# EasyEDA Pro project ProPrj_2025电赛拓展板7月_2025-07-14.epro

# Schematic Schematic1
Board Name: Board1; Create Date: 2025-07-11; Page Name: P1; Project Name: 2025电赛拓展板7月; Schematic Name: Schematic1; Update Date: 2025-07-13; Company: 嘉立创EDA; Page Size: A4; Version: V1.0
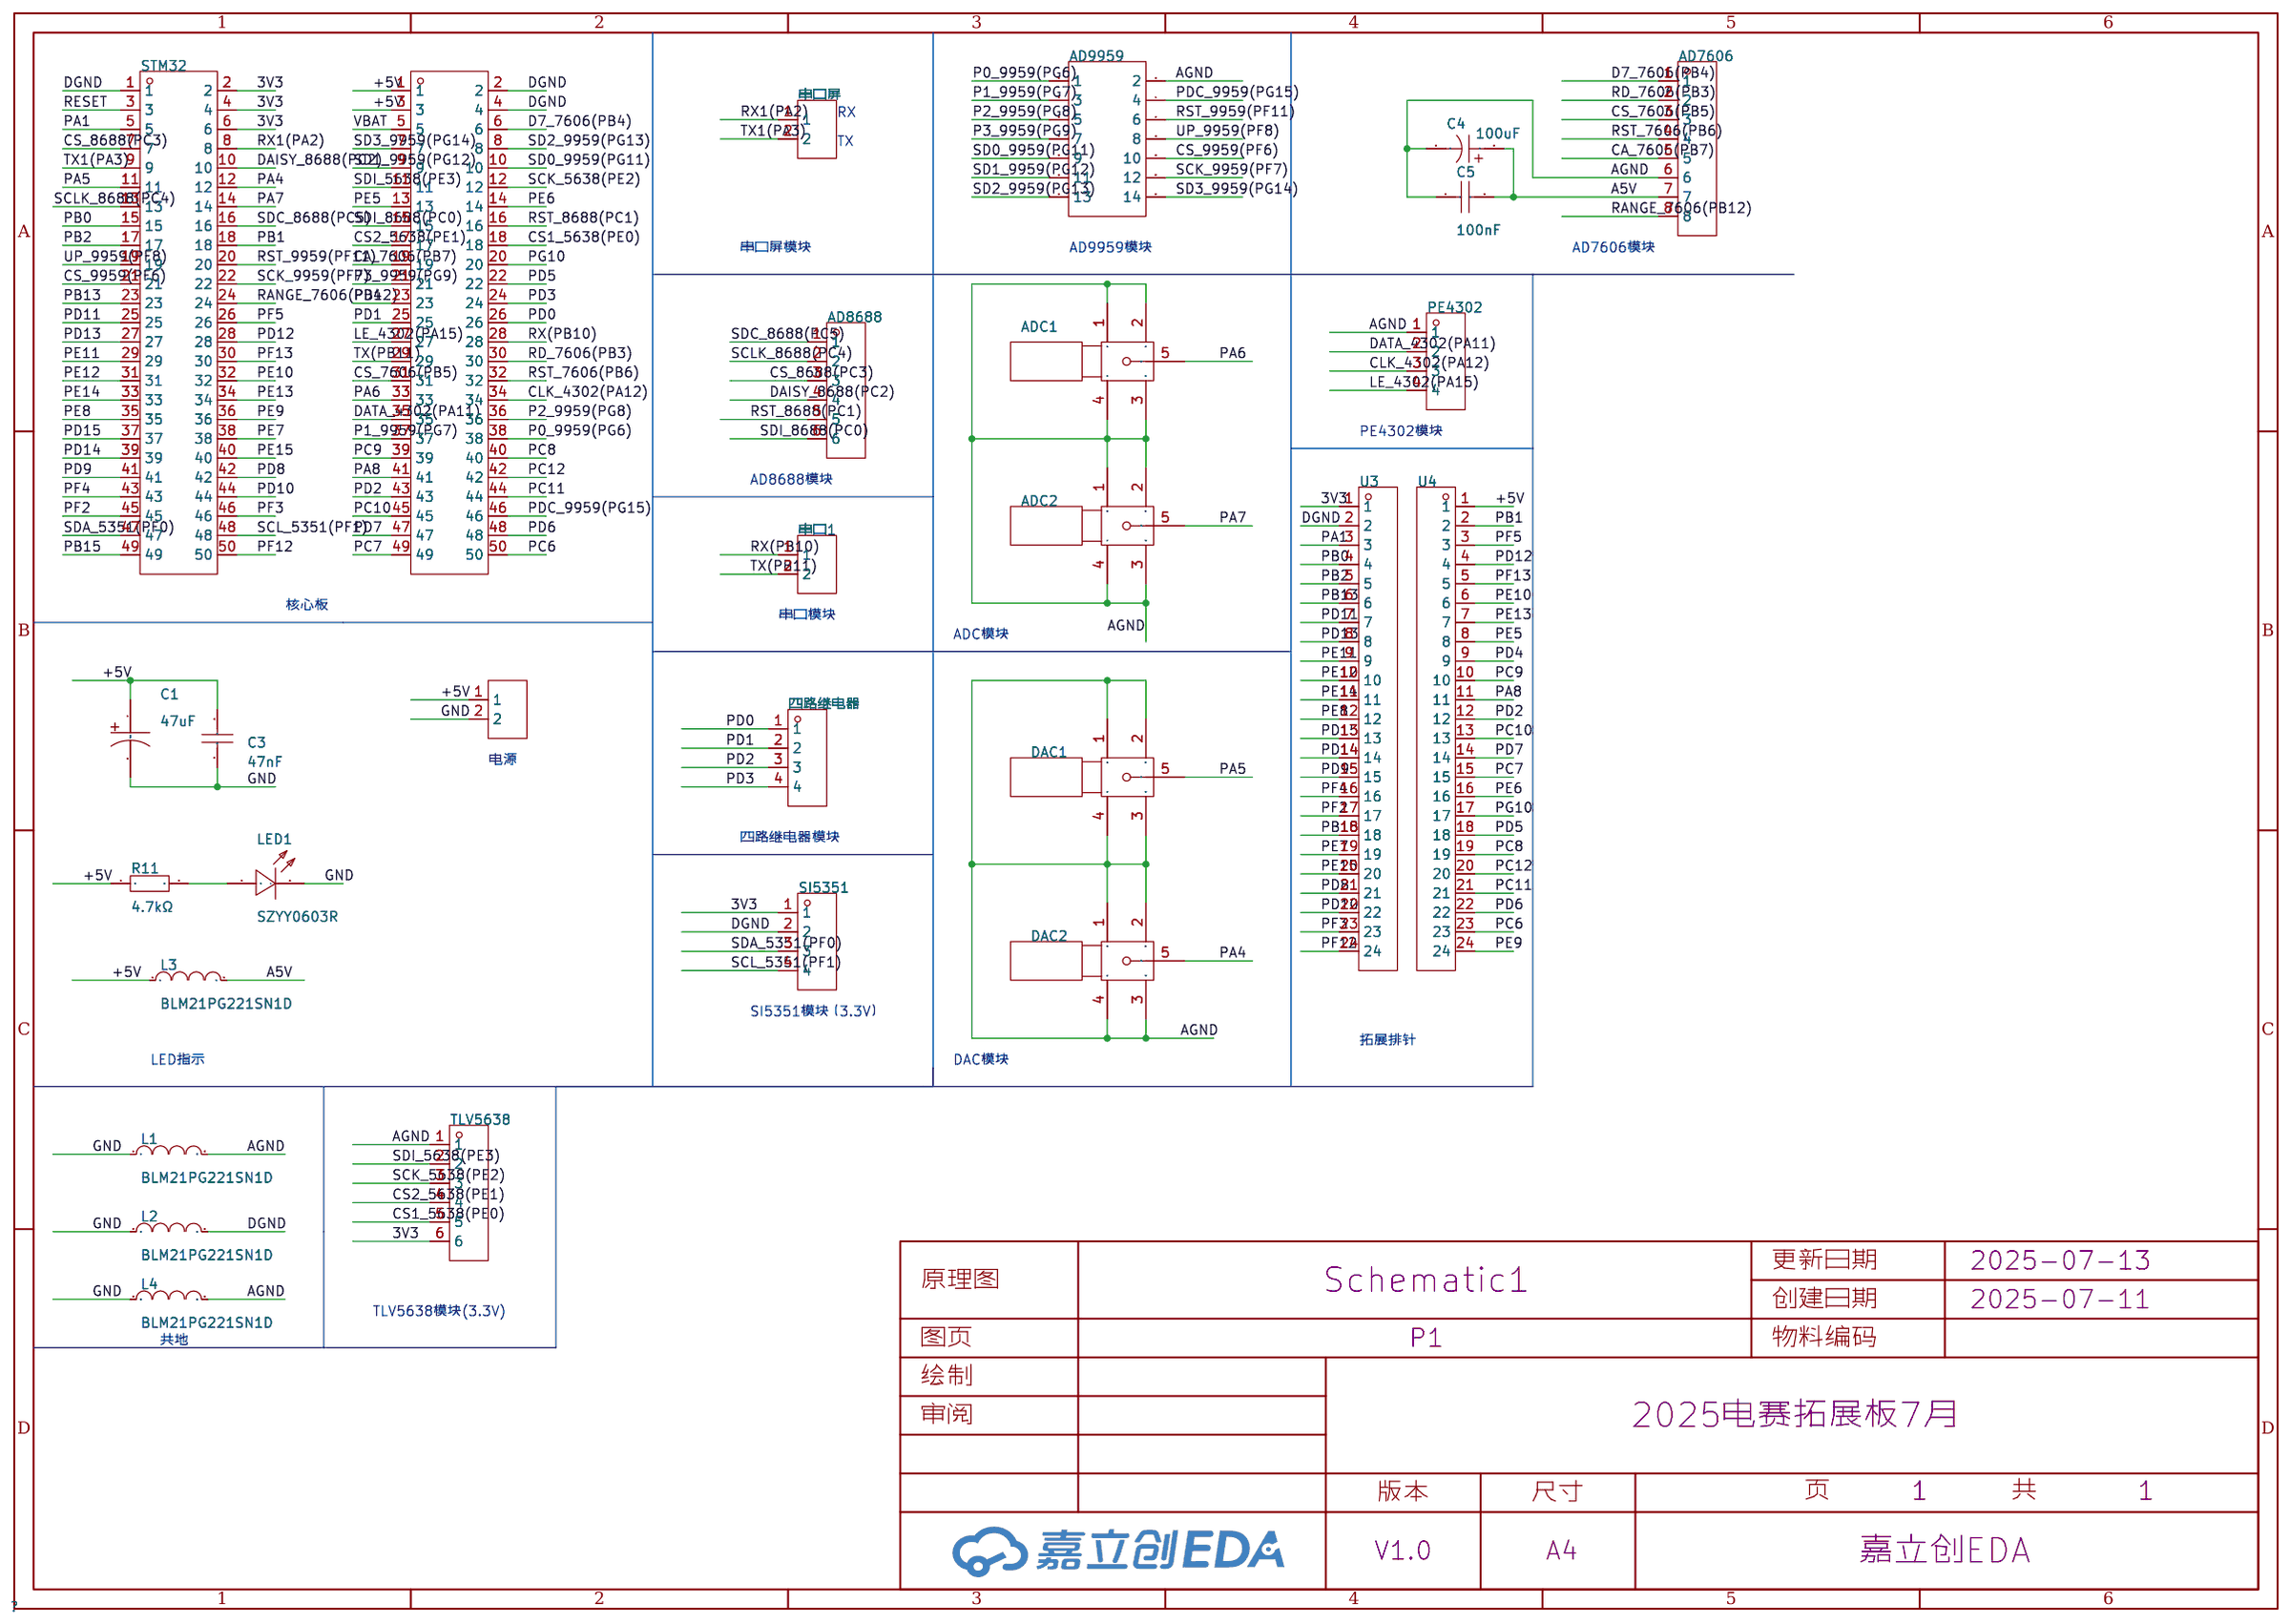
[diagram p0: schematic sheet]

## Parts
AD7606  ZX-XH2.54-8PZZ  [CONN-TH_8P-P2.50-XH2.54-8P]
AD8688  ZX-XH2.54-6PZZ  [CONN-TH_6P-P2.50_ZX-XH2.54-6PZZ]
AD9959  2.54-2*7P简牛  [IDC-TH_14P-P2.54-V-R2-C7-S2.54]
ADC1  BWSMA-KE-P001  [SMA-SMD_BWSMA-KE-P001]
ADC2  BWSMA-KE-P001  [SMA-SMD_BWSMA-KE-P001]
C1  47uF  [CAP-TH_BD5.0-P2.00-D0.8-FD]
C3  47nF  [C0805]
C4  100uF  [CAP-TH_BD8.0-P3.50-D0.5-FD]
C5  100nF  [C0805]
DAC1  BWSMA-KE-P001  [SMA-SMD_BWSMA-KE-P001]
DAC2  BWSMA-KE-P001  [SMA-SMD_BWSMA-KE-P001]
L1  BLM21PG221SN1D  [L0805]
L2  BLM21PG221SN1D  [L0805]
L3  BLM21PG221SN1D  [L0805]
L4  BLM21PG221SN1D  [L0805]
LED1  SZYY0603R  [LED0603-R-RD]
PE4302  ZX-XH2.54-4PZZ  [CONN-TH_4P-P2.50_4PIN]
R11  4.7kΩ  [R0805]
SI5351  ZX-XH2.54-4PZZ  [CONN-TH_4P-P2.50_4PIN]
STM32  ZX-PM2.54-2-25PY  [HDR-TH_50P-P2.54-V-F-R2-C25-S2.54-1]
TLV5638  ZX-XH2.54-6PZZ  [CONN-TH_6P-P2.50_ZX-XH2.54-6PZZ]
U2  ZX-PM2.54-2-25PY  [HDR-TH_50P-P2.54-V-F-R2-C25-S2.54-1]
U3  HC-PM254-8.5H-1x24PZ  [HDR-TH_24P-P2.54-V-F]
U4  HC-PM254-8.5H-1x24PZ  [HDR-TH_24P-P2.54-V-F]
串口  ZX-XH2.54-2PZZ  [CONN-TH_2P-P2.50_HX25003-2A]
串口1  ZX-XH2.54-2PZZ  [CONN-TH_2P-P2.50_HX25003-2A]
串口屏  ZX-XH2.54-2PZZ  [CONN-TH_2P-P2.50_HX25003-2A]
四路继电器  ZX-XH2.54-4PZZ  [CONN-TH_4P-P2.50_4PIN]

## Library data of the parts
AD7606 = ZX-XH2.54-8PZZ: 插针结构:1x8P;间距:2.5mm;安装方式:直插;参考系列:XH;总PIN数:8P;排数:1;每排PIN数:8;行距:-;额定电流:3A;触头材质:黄铜;触头镀层:锡;工作温度:-25℃~+85℃;; LCSC Part Name: 1x8P 间距:2.5mm 直插 系列:XH; Supplier Part: C7429638; Manufacturer: Megastar(兆星); Supplier Footprint: 插件,P=2.5mm; JLCPCB Part Class: 扩展库; Datasheet: https://atta.szlcsc.com/upload/public/pdf/source/20230619/688603DEA58996C00B1F33C46797D2C3.pdf; Supplier: LCSC; Pins Structure: 1x8P; Pitch: 2.5mm; Mounting Type: 直插; Reference Series: XH; Number of Pins: 8P; Number of Rows: 1; Number of PINs Per Row: 8; Current Rating: 3A; Contact Material: 黄铜; Contact Plating: 锡; Operating Temperature: -25℃~+85℃; Voltage Rating: 250V; Plastic Material: PA66; Flame Retardant Rating: UL94V-0; Color: 白色; Z-Height of the Board: 7mm; X-Length of Bottom Edge on Board (Spacing Line): 22.5mm; Y-Width of Bottom Edge on Board: 5.9mm
AD8688 TLV5638 = ZX-XH2.54-6PZZ: 插针结构:1x6P;间距:2.5mm;安装方式:直插;参考系列:XH;总PIN数:6P;排数:1;每排PIN数:6;行距:-;额定电流:3A;触头材质:黄铜;触头镀层:锡;工作温度:-25℃~+85℃;; LCSC Part Name: 1x6P 间距:2.5mm 直插 系列:XH; Supplier Part: C7429636; Manufacturer: Megastar(兆星); Supplier Footprint: 插件,P=2.5mm; JLCPCB Part Class: 扩展库; Datasheet: https://atta.szlcsc.com/upload/public/pdf/source/20230619/1243AD0A516E39CD3D274D8985780568.pdf; Supplier: LCSC; Pins Structure: 1x6P; Pitch: 2.5mm; Mounting Type: 直插; Reference Series: XH; Number of Pins: 6P; Number of Rows: 1; Number of PINs Per Row: 6; Current Rating: 3A; Contact Material: 黄铜; Contact Plating: 锡; Operating Temperature: -25℃~+85℃; Voltage Rating: 250V; Plastic Material: PA66; Flame Retardant Rating: UL94V-0; Color: 白色; Z-Height of the Board: 7mm; X-Length of Bottom Edge on Board (Spacing Line): 17.5mm; Y-Width of Bottom Edge on Board: 5.9mm
AD9959 = 2.54-2*7P简牛: 连接器类型:简牛座;间距:2.54mm;结构:2x7P;封装形式:直插;行距:2.54mm;排数:2;每排PIN数:7;触头材质:黄铜;触头镀层:金;; LCSC Part Name: 2.54mm 2x7P 排数:2 每排P数:7; Supplier Part: C11215; Manufacturer: BOOMELE(博穆精密); Supplier Footprint: 插件,P=2.54mm; Datasheet: https://atta.szlcsc.com/upload/public/pdf/source/20131122/1457706661483.pdf; Supplier: LCSC; Connector Type: 简牛座; Pitch: 2.54mm; Structure: 2x7P; Holder Type: 直插; Row Spacing: 2.54mm; Number of Rows: 2; Pin Number in each Row: 7; Contact Material: 黄铜; Contact Plating: 金
ADC1 ADC2 DAC1 DAC2 = BWSMA-KE-P001: 连接器类型:板端;接口类型:内孔;端口数量:1;接口直径:5.2mm;接口长度/高度:-;频率-最大值:-;射频系列:SMA;阻抗:50Ω;样式:偏脚;工作温度范围:-;; LCSC Part Name: 内孔 SMA 偏脚; Supplier Part: C496550; Manufacturer: BAT WIRELESS(蝙蝠无线); Supplier Footprint: SMD; Datasheet: https://atta.szlcsc.com/upload/public/pdf/source/20240320/28FD502871C976DFF213ABFCF2A0ED51.pdf; Supplier: LCSC; Connector Type: 板端; Interface Type: 内孔; Number of Ports: 1; Interface Diameter: 5.2mm; RF Series: SMA; Impedance: 50Ω; Style: 偏脚
C1 = NXB25V47M5*11 2.5TP: 容值:47uF;精度:±20%;额定电压:25V;纹波电流:250mA@100kHz;等效串联电阻(ESR):300mΩ@100kHz;; LCSC Part Name: 47uF ±20% 25V; Supplier Part: C371230; Manufacturer: SAMYOUNG(韩国三莹); Supplier Footprint: 插件,D5xL11mm; JLCPCB Part Class: 扩展库; Datasheet: https://atta.szlcsc.com/upload/public/pdf/source/20190227/C371244_FA85FFEFC2961227CF12E3CCE8C34A7D.pdf; Supplier: LCSC; Tolerance: ±20%; Voltage Rating: 25V; Ripple Current: 250mA@100kHz; Equivalent Series Resistance(ESR): 300mΩ@100kHz; Pin Spacing: 2mm; Diameter: 5mm; Height - Seated (Max): 11mm; Lifetime: 2000hrs@105℃; Operating Temperature: -40℃~+105℃
C3 = CL21B473KBCNNNC: 容值:47nF;精度:±10%;额定电压:50V;材质(温度系数):X7R;; LCSC Part Name: 47nF ±10% 50V; Supplier Part: C53134; Manufacturer: SAMSUNG(三星); Supplier Footprint: 0805; JLCPCB Part Class: 基础库; Datasheet: https://atta.szlcsc.com/upload/public/pdf/source/20160218/1457707763339.pdf; Supplier: LCSC; Tolerance: ±10%; Voltage Rated: 50V; Temperature Coefficient: X7R
C4 = ERG50V100M8X12: 容值:100uF;精度:±20%;额定电压:50V;纹波电流:680mA@120Hz;等效串联电阻(ESR):120mΩ;; LCSC Part Name: 100uF ±20% 50V; Supplier Part: C47344183; Manufacturer: 捷而瑞; Supplier Footprint: 插件,D8xL12mm; JLCPCB Part Class: 扩展库; Datasheet: https://atta.szlcsc.com/upload/public/pdf/source/20250526/717B4C76834FE5C4A331D19A222D031C.pdf; Supplier: LCSC; Tolerance: ±20%; Voltage Rating: 50V; Ripple Current: 680mA@120Hz; Equivalent Series Resistance(ESR): 120mΩ; Diameter: 8mm; Height - Seated (Max): 12mm; Lifetime: 4000hrs@105℃; Operating Temperature: -40℃~+105℃
C5 = CL21B104KBCNNNC: 容值:100nF;精度:±10%;额定电压:50V;材质(温度系数):X7R;; LCSC Part Name: 100nF ±10% 50V; Supplier Part: C1711; Manufacturer: SAMSUNG(三星); Supplier Footprint: 0805; JLCPCB Part Class: 扩展库; Datasheet: https://atta.szlcsc.com/upload/public/pdf/source/20160218/1457707763339.pdf; Supplier: LCSC; Tolerance: ±10%; Voltage Rated: 50V; Temperature Coefficient: X7R
L1-L4 = BLM21PG221SN1D: 标称阻抗@测试频率:220Ω@100MHz;误差:±25%;直流电阻(RDC):45mΩ;; LCSC Part Name: 单路 0805磁珠 阻抗220Ω@100MHz; Supplier Part: C85840; Manufacturer: muRata(村田); Supplier Footprint: 0805; JLCPCB Part Class: 扩展库; Datasheet: https://atta.szlcsc.com/upload/public/pdf/source/20180326/C118443_3FAC30E9A4F0E6B81275543C61E0685E.pdf; Supplier: LCSC; Impedance @ Frequency: 220Ω@100MHz; Tolerance: ±25%; DC Resistance: 45mΩ; Current Rating: 2A; Circuits: 1
LED1 = SZYY0603R: 发光颜色:红色;功率:40mW;正向电流:20mA;主波长:615nm~630nm;二极管配置:-;透镜颜色:无色透明透镜;色温:-;发光角度:120°;载带方式:-;工作温度:-40℃~+85℃;; LCSC Part Name: 红灯; Supplier Part: C434419; Manufacturer: yongyu(永裕光电); Supplier Footprint: 0603; JLCPCB Part Class: 扩展库; Datasheet: https://atta.szlcsc.com/upload/public/pdf/source/20191204/C434419_0B955C1F73FF88449D9A795B6FF49070.pdf; Supplier: LCSC; Emitted Color: 红色; Power Dissipation: 40mW; Forward Current: 20mA; Dominant Wavelength: 615nm~630nm; Peak Wavelength: 645nm; Lens Color: 无色透明透镜; Viewing Angle: 120°; Operating Temperature: -40℃~+85℃
PE4302 SI5351 四路继电器 = ZX-XH2.54-4PZZ: 插针结构:1x4P;间距:2.5mm;安装方式:直插;参考系列:XH;总PIN数:4P;排数:1;每排PIN数:4;行距:-;额定电流:3A;触头材质:黄铜;触头镀层:锡;工作温度:-25℃~+85℃;; LCSC Part Name: 1x4P 间距:2.5mm 直插 系列:XH; Supplier Part: C7429634; Manufacturer: Megastar(兆星); Supplier Footprint: 插件,P=2.5mm; JLCPCB Part Class: 扩展库; Datasheet: https://atta.szlcsc.com/upload/public/pdf/source/20230619/B529A2163E0159A644AB3383D208FB03.pdf; Supplier: LCSC; Pins Structure: 1x4P; Pitch: 2.5mm; Mounting Type: 直插; Reference Series: XH; Number of Pins: 4P; Number of Rows: 1; Number of PINs Per Row: 4; Current Rating: 3A; Contact Material: 黄铜; Contact Plating: 锡; Operating Temperature: -25℃~+85℃; Voltage Rating: 250V; Plastic Material: PA66; Flame Retardant Rating: UL94V-0; Color: 白色; Z-Height of the Board: 7mm; X-Length of Bottom Edge on Board (Spacing Line): 12.5mm; Y-Width of Bottom Edge on Board: 5.9mm
R11 = 0805W8F4701T5E: 电阻类型:厚膜电阻;阻值:4.7kΩ;精度:±1%;功率:125mW;最大工作电压:150V;温度系数:±100ppm/℃;; LCSC Part Name: 4.7kΩ ±1% 125mW 厚膜电阻; Supplier Part: C17673; Manufacturer: UNI-ROYAL(厚声); Supplier Footprint: 0805; JLCPCB Part Class: 基础库; Datasheet: https://atta.szlcsc.com/upload/public/pdf/source/20200306/C422600_1E6D84923E4A46A82E41ADD87F860B5C.pdf; Supplier: LCSC; Type: 厚膜电阻; Tolerance: ±1%; Power(Watts): 125mW; Overload Voltage (Max): 150V; Temperature Coefficient: ±100ppm/℃; Operating Temperature Range: -55℃~+155℃
STM32 U2 = ZX-PM2.54-2-25PY: 插孔结构:2x25P;间距:2.54mm;行距:2.54mm;圆孔/方孔:方孔;安装类型:直插;排数:双排;总孔位数:50P;额定电流:-;额定电压:1kV;插孔方向:顶部;塑高:8.5mm;触头材质:-;触头镀层:金;工作温度范围:-40℃~+105℃;焊接温度(最大值):260℃@5S;; LCSC Part Name: 2x25P 间距:2.54mm 直插; Supplier Part: C7499355; Manufacturer: Megastar(兆星); Supplier Footprint: 插件,P=2.54mm; JLCPCB Part Class: 扩展库; Datasheet: https://atta.szlcsc.com/upload/public/pdf/source/20231122/49E5BFC403566950E1C41AC60FCE7E93.pdf; Supplier: LCSC; Holes Structure: 2x25P; Pitch: 2.54mm; Row Spacing: 2.54mm; Circular Hole / Square Hole: 方孔; Mounting Type: 直插; Number of Rows: 双排; Number of Holes: 50P; Voltage Rating (Max): 1kV; Holes Direction: 顶部; Insulation Height: 8.5mm; Contact Plating: 金; Operating Temperature Range: -40℃~+105℃; Soldering Temperature(Max): 260℃@5S
U3 U4 = HC-PM254-8.5H-1x24PZ: 插孔结构:1x24P;间距:2.54mm;行距:-;圆孔/方孔:方孔;安装方式:直插;排数:单排;总孔位数:24P;额定电流:3A;额定电压:-;插孔方向:顶部;塑高:8.5mm;触头材质:黄铜;触头镀层:金;工作温度:-40℃~+105℃;; LCSC Part Name: 间距2.54mm 1x24Pin 直插 PC3.0 H8.5; Supplier Part: C41376163; Manufacturer: HC(虹成电子); Supplier Footprint: 插件,P=2.54mm; JLCPCB Part Class: 扩展库; Datasheet: https://atta.szlcsc.com/upload/public/pdf/source/20250106/3FBD04873CC9DF7EB7D4CB725B508409.pdf; Supplier: LCSC; Holes Structure: 1x24P; Pitch: 2.54mm; Circular Hole / Square Hole: 方孔; Mounting Type: 直插; Number of Rows: 单排; Number of Positions: 24P; Current Rating: 3A; Holes Direction: 顶部; Insulation Height: 8.5mm; Contact Material: 黄铜; Contact Plating: 金; Operating Temperature: -40℃~+105℃; PIN Length: 3mm
串口 串口1 串口屏 = ZX-XH2.54-2PZZ: 插针结构:1x2P;间距:2.5mm;安装方式:直插;参考系列:XH;总PIN数:2P;排数:1;每排PIN数:2;行距:-;额定电流:3A;触头材质:黄铜;触头镀层:锡;工作温度:-25℃~+85℃;; LCSC Part Name: 1x2P 间距:2.5mm 直插 系列:XH; Supplier Part: C7429632; Manufacturer: Megastar(兆星); Supplier Footprint: 插件,P=2.5mm; JLCPCB Part Class: 扩展库; Datasheet: https://atta.szlcsc.com/upload/public/pdf/source/20230619/19BA6947230AA44A04D3EDD65E618FD0.pdf; Supplier: LCSC; Pins Structure: 1x2P; Pitch: 2.5mm; Mounting Type: 直插; Reference Series: XH; Number of Pins: 2P; Number of Rows: 1; Number of PINs Per Row: 2; Current Rating: 3A; Contact Material: 黄铜; Contact Plating: 锡; Operating Temperature: -25℃~+85℃; Voltage Rating: 250V; Plastic Material: PA66; Flame Retardant Rating: UL94V-0; Color: 白色; Z-Height of the Board: 7mm; X-Length of Bottom Edge on Board (Spacing Line): 7.5mm; Y-Width of Bottom Edge on Board: 5.9mm

## Nets
3V3: SI5351.1 STM32.2 STM32.4 STM32.6 TLV5638.6 U3.1
+5V: C1.1 C3.2 L3.1 R11.1 U2.1 U2.3 U4.1 串口.1
A5V: AD7606.7 C4.1 C5.2 L3.2
AGND: AD7606.6 AD9959.2 ADC1.1 ADC1.2 ADC1.3 ADC1.4 ADC2.1 ADC2.2 ADC2.3 ADC2.4 C4.2 C5.1 DAC1.1 DAC1.2 DAC1.3 DAC1.4 DAC2.1 DAC2.2 DAC2.3 DAC2.4 L1.2 L4.2 PE4302.1 TLV5638.1
DGND: L2.2 SI5351.2 STM32.1 U2.2 U2.4 U3.2
GND: C1.2 C3.1 L1.1 L2.1 L4.1 LED1.2(-) 串口.2
VBAT: U2.5
CA_7606(PB7): AD7606.5 U2.19
CLK_4302(PA12): PE4302.3 U2.34
CS1_5638(PE0): TLV5638.5 U2.18
CS2_5638(PE1): TLV5638.4 U2.17
CS_7606(PB5): AD7606.3 U2.31
CS_8688(PC3): AD8688.3 STM32.7
CS_9959(PF6): AD9959.10 STM32.21
D7_7606(PB4): AD7606.1 U2.6
DAISY_8688(PC2): AD8688.4 STM32.10
DATA_4302(PA11): PE4302.2 U2.35
LE_4302(PA15): PE4302.4 U2.27
P0_9959(PG6): AD9959.1 U2.38
P1_9959(PG7): AD9959.3 U2.37
P2_9959(PG8): AD9959.5 U2.36
P3_9959(PG9): AD9959.7 U2.21
PA1: STM32.5 U3.3
PA4: DAC2.5 STM32.12
PA5: DAC1.5 STM32.11
PA6: ADC1.5 U2.33
PA7: ADC2.5 STM32.14
PA8: U2.41 U4.11
PB0: STM32.15 U3.4
PB1: STM32.18 U4.2
PB2: STM32.17 U3.5
PB13: STM32.23 U3.6
PB15: STM32.49 U3.18
PC6: U2.50 U4.23
PC7: U2.49 U4.15
PC8: U2.40 U4.19
PC9: U2.39 U4.10
PC10: U2.45 U4.13
PC11: U2.44 U4.21
PC12: U2.42 U4.20
PD0: U2.26 四路继电器.1
PD1: U2.25 四路继电器.2
PD2: U2.43 U4.12 四路继电器.3
PD3: U2.24 四路继电器.4
PD4: U2.23 U4.9
PD5: U2.22 U4.18
PD6: U2.48 U4.22
PD7: U2.47 U4.14
PD8: STM32.42 U3.21
PD9: STM32.41 U3.15
PD10: STM32.44 U3.22
PD11: STM32.25 U3.7
PD12: STM32.28 U4.4
PD13: STM32.27 U3.8
PD14: STM32.39 U3.14
PD15: STM32.37 U3.13
PDC_9959(PG15): AD9959.4 U2.46
PE5: U2.13 U4.8
PE6: U2.14 U4.16
PE7: STM32.38 U3.19
PE8: STM32.35 U3.12
PE9: STM32.36 U4.24
PE10: STM32.32 U4.6
PE11: STM32.29 U3.9
PE12: STM32.31 U3.10
PE13: STM32.34 U4.7
PE14: STM32.33 U3.11
PE15: STM32.40 U3.20
PF2: STM32.45 U3.17
PF3: STM32.46 U3.23
PF4: STM32.43 U3.16
PF5: STM32.26 U4.3
PF12: STM32.50 U3.24
PF13: STM32.30 U4.5
PG10: U2.20 U4.17
RANGE_7606(PB12): AD7606.8 STM32.24
RD_7606(PB3): AD7606.2 U2.30
RESET: STM32.3
RST_7606(PB6): AD7606.4 U2.32
RST_8688(PC1): AD8688.5 U2.16
RST_9959(PF11): AD9959.6 STM32.20
RX1(PA2): STM32.8 串口屏.1
RX(PB10): U2.28 串口1.1
SCK_5638(PE2): TLV5638.3 U2.12
SCK_9959(PF7): AD9959.12 STM32.22
SCL_5351(PF1): SI5351.4 STM32.48
SCLK_8688(PC4): AD8688.2 STM32.13
SD0_9959(PG11): AD9959.9 U2.10
SD1_9959(PG12): AD9959.11 U2.9
SD2_9959(PG13): AD9959.13 U2.8
SD3_9959(PG14): AD9959.14 U2.7
SDA_5351(PF0): SI5351.3 STM32.47
SDC_8688(PC5): AD8688.1 STM32.16
SDI_5638(PE3): TLV5638.2 U2.11
SDI_8688(PC0): AD8688.6 U2.15
TX1(PA3): STM32.9 串口屏.2
TX(PB11): U2.29 串口1.2
UP_9959(PF8): AD9959.8 STM32.19
$1N1573: LED1.1(+) R11.2

## Notes on the sheet
- RX
- TX
- 串口屏模块
- AD9959模块
- AD7606模块
- PE4302模块
- AD8688模块
- 核心板
- 串口模块
- ADC模块
- 电源
- 四路继电器模块
- SI5351模块（3.3V）
- 拓展排针
- LED指示
- DAC模块
- TLV5638模块(3.3V)
- 共地

# Board PCB1
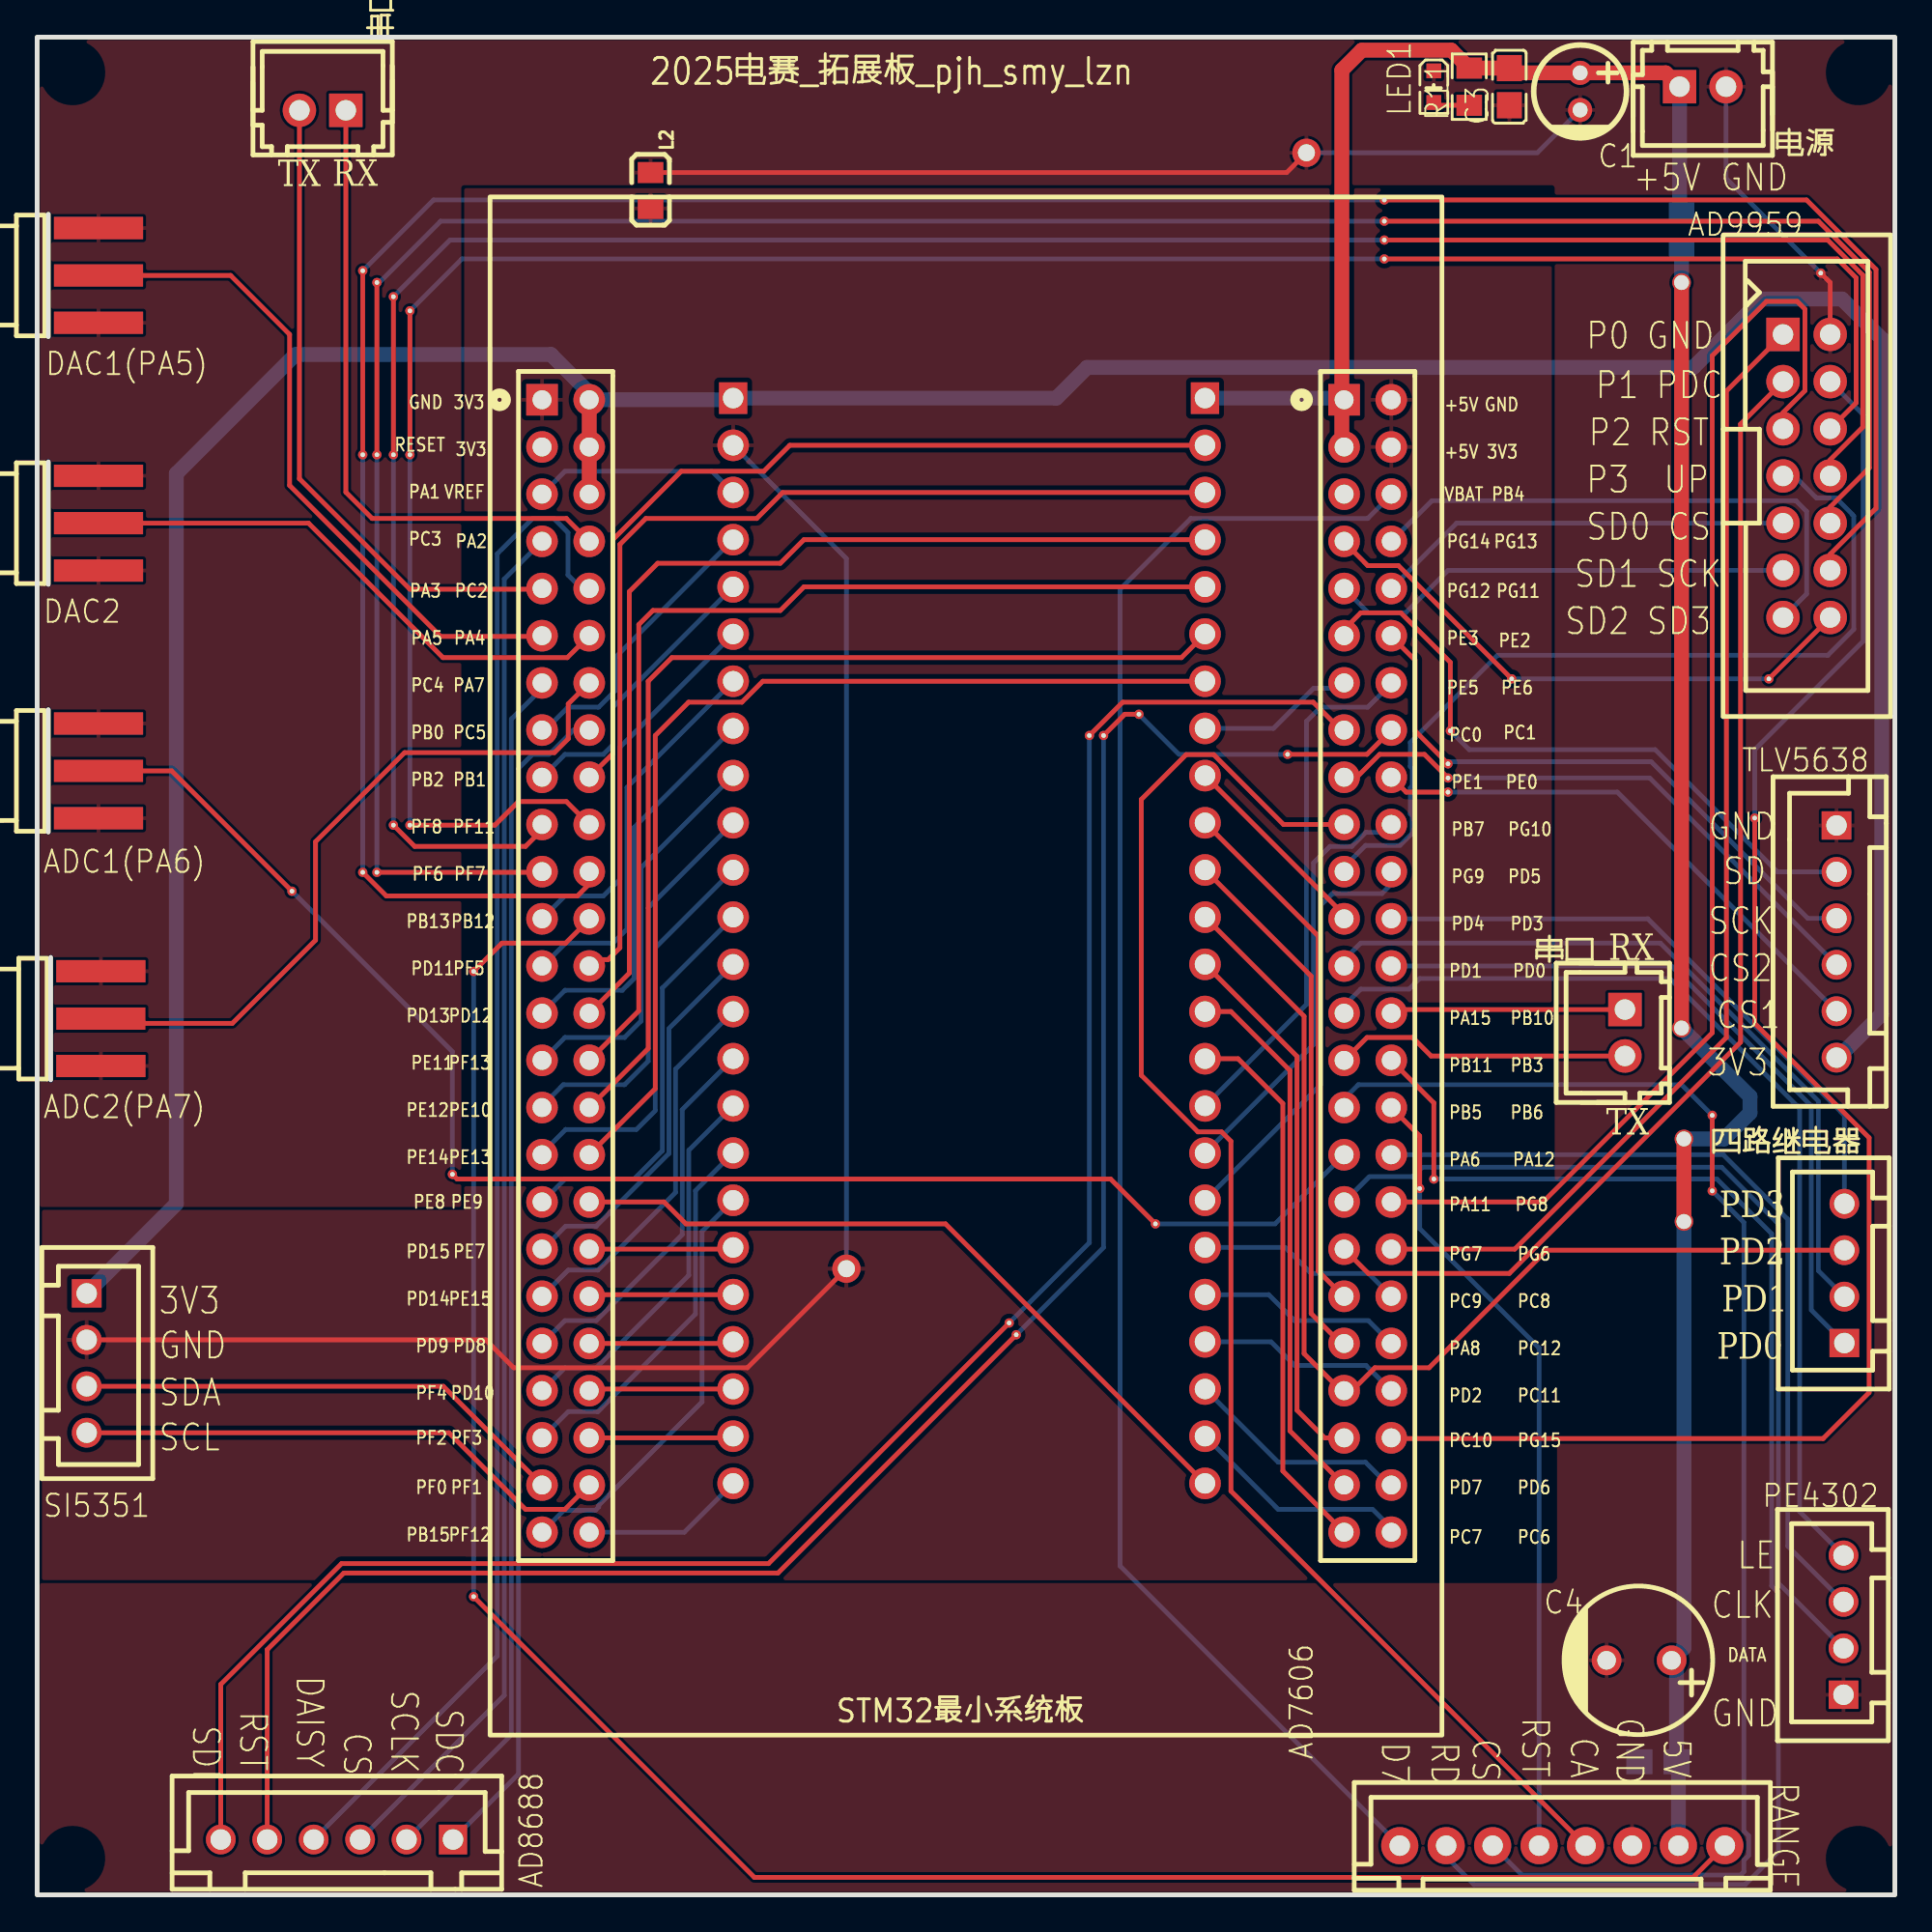
[diagram p1: board, top side]
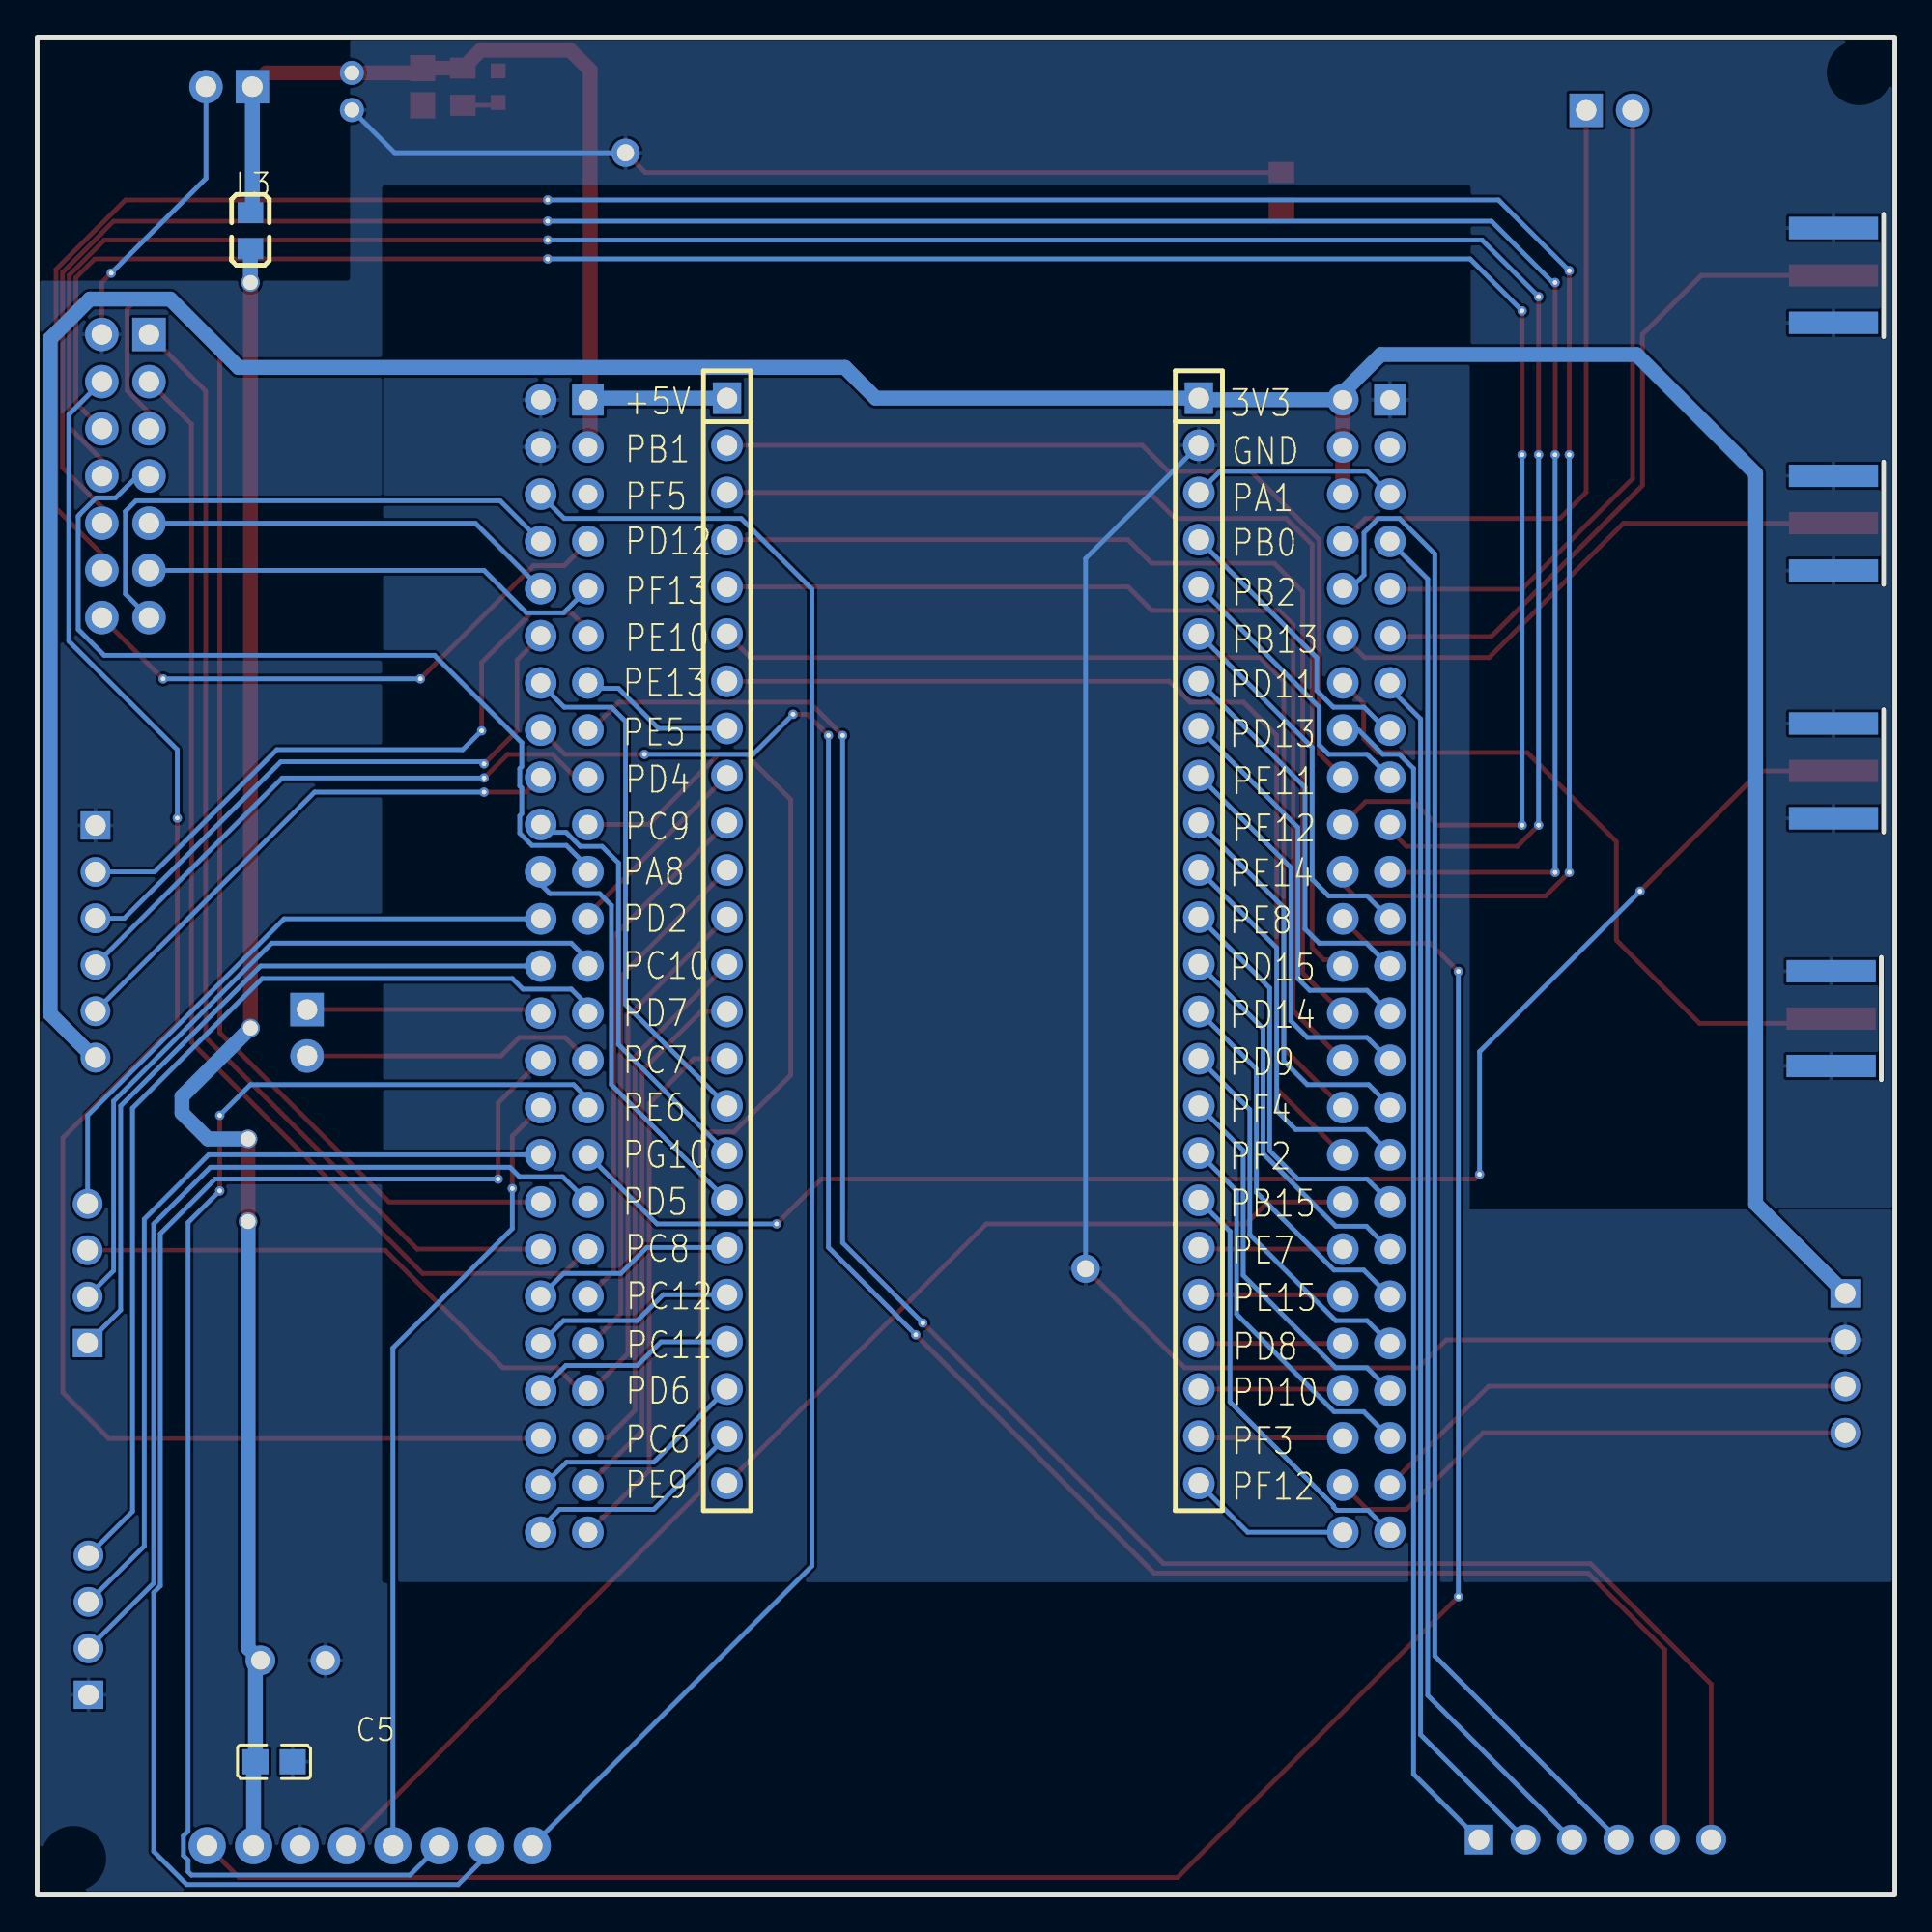
[diagram p2: board, bottom side, seen from below]

Outline 100 x 100 mm; copper layers: Top Layer, Bottom Layer. Coordinates in mm from the lower left corner of the outline.
Outline path: rectangle 0,100 100,0
Stack: Top Layer 0.035mm / Dielectric1 1.51mm FR4 er 4.5 / Bottom Layer 0.035mm

## Design rules (mm)
template: JLCPCB Capability(Two Layers Board)
spacing copperThickness1oz (default): track to track 0.102, other pairs 0.152 to 0.3
spacing copperThickness2oz: track to track 0.203, other pairs 0.152 to 0.3
track width copperThickness1oz (default): min 0.127, default 0.254, max 2.54
track width copperThickness2oz: min 0.203, default 0.254, max 2.54
differential pair differentialPair (default): width min 0.127, default 0.254, max 2.54; gap min 0.152, default 0.152
via viaSize (default): diameter min 0.5, default 0.61, max 10; hole min 0.3, default 0.305, max 6.3

## Placement (name value [footprint] x y rotation side)
AD7606  ZX-XH2.54-8PZZ  [CONN-TH_8P-P2.50-XH2.54-8P]  82.1 2.65 180 top
AD8688  ZX-XH2.54-6PZZ  [CONN-TH_6P-P2.50_ZX-XH2.54-6PZZ]  16.13 2.98 0 top
AD9959  2.54-2*7P简牛  [IDC-TH_14P-P2.54-V-R2-C7-S2.54]  95.25 76.38 270 top
ADC1(PA6)  BWSMA-KE-P001  [SMA-SMD_BWSMA-KE-P001]  3.3 60.5 180 top
ADC2(PA7)  BWSMA-KE-P001  [SMA-SMD_BWSMA-KE-P001]  3.43 47.17 180 top
C1  47uF  [CAP-TH_BD5.0-P2.00-D0.8-FD]  83.06 97.08 270 top
C3  47nF  [C0805]  79.25 97.33 90 top
C4  100uF  [CAP-TH_BD8.0-P3.50-D0.5-FD]  86.23 12.62 180 top
C5  100nF  [C0805]  87.25 7.16 0 bottom
DAC1(PA5)  BWSMA-KE-P001  [SMA-SMD_BWSMA-KE-P001]  3.3 87.17 180 top
DAC2  BWSMA-KE-P001  [SMA-SMD_BWSMA-KE-P001]  3.3 73.84 180 top
L2  BLM21PG221SN1D  [L0805]  33.02 91.75 270 top
L3  BLM21PG221SN1D  [L0805]  88.52 89.59 270 bottom
LED1  SZYY0603R  [LED0603-R-RD]  75.18 97.33 270 top
NOREF  -  [Pad_e1928]  43.56 33.71 0 top
NOREF#2  -  [Pad_e983]  59.31 63.55 0 top
NOREF#3  -  [Pad_e890]  75.18 38.53 0 top
NOREF#4  -  [Pad_e1287]  19.18 57.58 0 top
NOREF#5  -  [Pad_e1280]  20.07 77.52 0 top
NOREF#6  -  [Pad_e1405]  88.65 40.69 0 top
NOREF#7  -  [Pad_e1278]  18.29 77.52 0 top
NOREF#8  -  [Pad_e988]  67.31 61.39 0 top
NOREF#9  -  [Pad_e1345]  13.72 54.03 0 top
NOREF#10  -  [Pad_e902]  90.17 37.9 0 top
NOREF#11  -  [Pad_e727]  75.95 59.36 0 top
NOREF#12  -  [Pad_e1028]  23.5 49.71 0 top
NOREF#13  -  [Pad_e1277]  17.53 77.52 0 top
NOREF#14  -  [Pad_e1286]  18.29 55.04 0 top
NOREF#15  -  [Pad_e1231]  72.52 91.24 0 top
NOREF#16  -  [Pad_e1285]  17.53 55.04 0 top
NOREF#17  -  [Pad_e1232]  72.52 90.09 0 top
NOREF#18  -  [Pad_e965]  56.64 62.41 0 top
NOREF#19  -  [Pad_e1264]  17.53 87.43 0 top
NOREF#20  -  [Pad_e725]  75.95 60.12 0 top
NOREF#21  -  [Pad_e1279]  19.18 77.52 0 top
NOREF#22  -  [Pad_e1233]  72.52 89.08 0 top
NOREF#23  -  [Pad_e1139]  93.22 65.46 0 top
NOREF#24  -  [Pad_e1354]  60.2 36.12 0 top
NOREF#25  -  [Pad_e1234]  72.52 88.06 0 top
NOREF#26  -  [Pad_e1407]  88.65 36.25 0 top
NOREF#27  -  [Pad_e1266]  19.18 86.03 0 top
NOREF#28  -  [Pad_e1348]  22.35 38.79 0 top
NOREF#29  -  [Pad_e3359]  96.01 87.3 0 top
NOREF#30  -  [Pad_e966]  57.4 62.41 0 top
NOREF#31  -  [Pad_e960]  52.71 30.15 0 top
NOREF#32  -  [Pad_e959]  52.32 30.78 0 top
NOREF#33  -  [Pad_e1400]  88.52 46.66 0 top
NOREF#34  -  [Pad_e728]  76.07 62.66 0 top
NOREF#35  -  [Pad_e1934]  68.33 93.78 0 top
NOREF#36  -  [Pad_e1267]  20.07 85.27 0 top
NOREF#37  -  [Pad_e1026]  23.5 16.05 0 top
NOREF#38  -  [Pad_e1397]  88.52 86.79 0 top
NOREF#39  -  [Pad_e1141]  79.38 65.46 0 top
NOREF#40  -  [Pad_e1288]  20.07 57.58 0 top
NOREF#41  -  [Pad_e1171]  92.46 57.96 0 top
NOREF#42  -  [Pad_e1355]  74.42 38.02 0 top
NOREF#43  -  [Pad_e904]  90.17 41.96 0 top
NOREF#44  -  [Pad_e732]  75.95 60.88 0 top
NOREF#45  -  [Pad_e1265]  18.29 86.79 0 top
PE4302  ZX-XH2.54-4PZZ  [CONN-TH_4P-P2.50_4PIN]  97.24 14.52 90 top
R11  4.7kΩ  [R0805]  77.09 97.33 270 top
SI5351  ZX-XH2.54-4PZZ  [CONN-TH_4P-P2.50_4PIN]  2.67 28.63 270 top
STM32最小系统板  ZX-PM2.54-2-25PY  [HDR-TH_50P-P2.54-V-F-R2-C25-S2.54-1]  28.45 50 270 top
TLV5638  ZX-XH2.54-6PZZ  [CONN-TH_6P-P2.50_ZX-XH2.54-6PZZ]  96.86 51.32 90 top
U2  ZX-PM2.54-2-25PY  [HDR-TH_50P-P2.54-V-F-R2-C25-S2.54-1]  71.62 50 270 top
U3  HC-PM254-8.5H-1x24PZ  [HDR-TH_24P-P2.54-V-F]  37.47 51.36 270 bottom
U4  HC-PM254-8.5H-1x24PZ  [HDR-TH_24P-P2.54-V-F]  62.87 51.36 270 bottom
串口  ZX-XH2.54-2PZZ  [CONN-TH_2P-P2.50_HX25003-2A]  85.47 46.41 270 top
串口屏  ZX-XH2.54-2PZZ  [CONN-TH_2P-P2.50_HX25003-2A]  15.37 96.06 180 top
四路继电器  ZX-XH2.54-4PZZ  [CONN-TH_4P-P2.50_4PIN]  97.28 33.45 90 top
电源  ZX-XH2.54-2PZZ  [CONN-TH_2P-P2.50_HX25003-2A]  89.66 97.33 0 top

## Footprints (pads in the part's own frame, mm; a bottom-side part is the same pattern mirrored in y, then rotated)
C0805
  rect 1.41x1.35 smd: 1(-1,0) 2(1,0)
CAP-TH_BD5.0-P2.00-D0.8-FD
  round 1.3 hole 0.8: 1(-1,0) 2(1,0)
CAP-TH_BD8.0-P3.50-D0.5-FD
  round 1.6 hole 1: 1(-1.75,0) 2(1.75,0)
CONN-TH_2P-P2.50_HX25003-2A
  rect 1.8x1.8 hole 1.1: 1(-1.25,0)
  round 1.8 hole 1.1: 2(1.25,0)
CONN-TH_4P-P2.50_4PIN
  rect 1.524x1.6 hole 1.1: 1(-3.75,0)
  round 1.6 hole 1.1: 2(-1.25,0) 3(1.25,0) 4(3.75,0)
CONN-TH_6P-P2.50_ZX-XH2.54-6PZZ
  rect 1.524x1.6 hole 1.1: 1(6.25,0)
  round 1.6 hole 1.1: 2(3.75,0) 3(1.25,0) 4(-1.25,0) 5(-3.75,0) 6(-6.25,0)
CONN-TH_8P-P2.50-XH2.54-8P
  round 2 hole 1.1: 1(8.75,0) 2(6.25,0) 3(3.75,0) 4(1.25,0) 5(-1.25,0) 6(-3.75,0) 7(-6.25,0) 8(-8.75,0)
HDR-TH_24P-P2.54-V-F
  rect 1.7x1.524 hole 1.1: 1(-29.21,0)
  round 1.7 hole 1.1: 2(-26.67,0) 3(-24.13,0) 4(-21.59,0) 5(-19.05,0) 6(-16.51,0) 7(-13.97,0) 8(-11.43,0) 9(-8.89,0) 10(-6.35,0) 11(-3.81,0) 12(-1.27,0) 13(1.27,0) 14(3.81,0) 15(6.35,0) 16(8.89,0) 17(11.43,0) 18(13.97,0) 19(16.51,0) 20(19.05,0) 21(21.59,0) 22(24.13,0) 23(26.67,0) 24(29.21,0)
HDR-TH_50P-P2.54-V-F-R2-C25-S2.54-1
  rect 1.7x1.7 hole 1.02: 1(-30.48,-1.27)
  round 1.7 hole 1.02: 2(-30.48,1.27) 3(-27.94,-1.27) 4(-27.94,1.27) 5(-25.4,-1.27) 6(-25.4,1.27) 7(-22.86,-1.27) 8(-22.86,1.27) 9(-20.32,-1.27) 10(-20.32,1.27) 11(-17.78,-1.27) 12(-17.78,1.27) 13(-15.24,-1.27) 14(-15.24,1.27) 15(-12.7,-1.27) 16(-12.7,1.27) 17(-10.16,-1.27) 18(-10.16,1.27) 19(-7.62,-1.27) 20(-7.62,1.27) 21(-5.08,-1.27) 22(-5.08,1.27) 23(-2.54,-1.27) 24(-2.54,1.27) 25(0,-1.27) 26(0,1.27) 27(2.54,-1.27) 28(2.54,1.27) 29(5.08,-1.27) 30(5.08,1.27) 31(7.62,-1.27) 32(7.62,1.27) 33(10.16,-1.27) 34(10.16,1.27) 35(12.7,-1.27) 36(12.7,1.27) 37(15.24,-1.27) 38(15.24,1.27) 39(17.78,-1.27) 40(17.78,1.27) 41(20.32,-1.27) 42(20.32,1.27) 43(22.86,-1.27) 44(22.86,1.27) 45(25.4,-1.27) 46(25.4,1.27) 47(27.94,-1.27) 48(27.94,1.27) 49(30.48,-1.27) 50(30.48,1.27)
IDC-TH_14P-P2.54-V-R2-C7-S2.54
  rect 1.8x1.8 hole 1.1: 1(-7.62,-1.27)
  round 1.8 hole 1.1: 2(-7.62,1.27) 3(-5.08,-1.27) 4(-5.08,1.27) 5(-2.54,-1.27) 6(-2.54,1.27) 7(0,-1.27) 8(0,1.27) 9(2.54,-1.27) 10(2.54,1.27) 11(5.08,-1.27) 12(5.08,1.27) 13(7.62,-1.27) 14(7.62,1.27)
L0805
  rect 1.133x1.377 smd: 1(-0.966,0) 2(0.966,0)
LED0603-R-RD
  rect 0.8x0.8 smd: 1(0.851,0) 2(-0.851,0)
Pad_e725
  round 0.5 hole 0.25: 1(0,0)
Pad_e727
  round 0.5 hole 0.25: 1(0,0)
Pad_e728
  round 0.5 hole 0.25: 1(0,0)
Pad_e732
  round 0.5 hole 0.25: 1(0,0)
Pad_e890
  round 0.5 hole 0.25: 1(0,0)
Pad_e902
  round 0.5 hole 0.25: 1(0,0)
Pad_e904
  round 0.5 hole 0.25: 1(0,0)
Pad_e959
  round 0.5 hole 0.25: 1(0,0)
Pad_e960
  round 0.5 hole 0.25: 1(0,0)
Pad_e965
  round 0.5 hole 0.25: 1(0,0)
Pad_e966
  round 0.5 hole 0.25: 1(0,0)
Pad_e983
  round 0.5 hole 0.25: 1(0,0)
Pad_e988
  round 0.5 hole 0.25: 1(0,0)
Pad_e1026
  round 0.5 hole 0.25: 1(0,0)
Pad_e1028
  round 0.5 hole 0.25: 1(0,0)
Pad_e1139
  round 0.5 hole 0.25: 1(0,0)
Pad_e1141
  round 0.5 hole 0.25: 1(0,0)
Pad_e1171
  round 0.5 hole 0.25: 1(0,0)
Pad_e1231
  round 0.5 hole 0.25: 1(0,0)
Pad_e1232
  round 0.5 hole 0.25: 1(0,0)
Pad_e1233
  round 0.5 hole 0.25: 1(0,0)
Pad_e1234
  round 0.5 hole 0.25: 1(0,0)
Pad_e1264
  round 0.5 hole 0.25: 1(0,0)
Pad_e1265
  round 0.5 hole 0.25: 1(0,0)
Pad_e1266
  round 0.5 hole 0.25: 1(0,0)
Pad_e1267
  round 0.5 hole 0.25: 1(0,0)
Pad_e1277
  round 0.5 hole 0.25: 1(0,0)
Pad_e1278
  round 0.5 hole 0.25: 1(0,0)
Pad_e1279
  round 0.5 hole 0.25: 1(0,0)
Pad_e1280
  round 0.5 hole 0.25: 1(0,0)
Pad_e1285
  round 0.5 hole 0.25: 1(0,0)
Pad_e1286
  round 0.5 hole 0.25: 1(0,0)
Pad_e1287
  round 0.5 hole 0.25: 1(0,0)
Pad_e1288
  round 0.5 hole 0.25: 1(0,0)
Pad_e1345
  round 0.5 hole 0.25: 1(0,0)
Pad_e1348
  round 0.5 hole 0.25: 1(0,0)
Pad_e1354
  round 0.5 hole 0.25: 1(0,0)
Pad_e1355
  round 0.5 hole 0.25: 1(0,0)
Pad_e1397
  round 1 hole 0.8: 1(0,0)
Pad_e1400
  round 1 hole 0.8: 1(0,0)
Pad_e1405
  round 1 hole 0.8: 1(0,0)
Pad_e1407
  round 1 hole 0.8: 1(0,0)
Pad_e1928
  round 1.524 hole 0.914: 1(0,0)
Pad_e1934
  round 1.524 hole 0.914: 1(0,0)
Pad_e3359
  round 0.5 hole 0.25: 1(0,0)
R0805
  rect 1.133x1.377 smd: 1(-1,0) 2(1,0)
SMA-SMD_BWSMA-KE-P001
  rect 4.8x1.2 smd: 1(0,-2.55) 2(0,2.55) 5(0,0)
  rect 4.8x1.2 smd far side: 3(0,2.55) 4(0,-2.55)

## Nets
3V3: SI5351.1 STM32最小系统板.2 STM32最小系统板.4 STM32最小系统板.6 TLV5638.6 U3.1
+5V: C1.1 C3.2 L3.1 R11.1 U2.1 U2.3 U4.1 电源.1
A5V: AD7606.7 C4.1 C5.2 L3.2 NOREF#6.1 NOREF#26.1 NOREF#33.1 NOREF#38.1
DGND: L2.2 NOREF.1 SI5351.2 STM32最小系统板.1 U2.2 U2.4 U3.2
GND: AD7606.6 AD9959.2 ADC1(PA6).1 ADC1(PA6).2 ADC1(PA6).3 ADC1(PA6).4 ADC2(PA7).1 ADC2(PA7).2 ADC2(PA7).3 ADC2(PA7).4 C1.2 C3.1 C4.2 C5.1 DAC1(PA5).1 DAC1(PA5).2 DAC1(PA5).3 DAC1(PA5).4 DAC2.1 DAC2.2 DAC2.3 DAC2.4 L2.1 LED1.2 NOREF#29.1 NOREF#35.1 PE4302.1 TLV5638.1 电源.2
VBAT: U2.5
CA_7606(PB7): AD7606.5 U2.19
CLK_4302(PA12): PE4302.3 U2.34
CS1_5638(PE0): NOREF#11.1 TLV5638.5 U2.18
CS2_5638(PE1): NOREF#20.1 TLV5638.4 U2.17
CS_7606(PB5): AD7606.3 NOREF#10.1 NOREF#43.1 U2.31
CS_8688(PC3): AD8688.3 STM32最小系统板.7
CS_9959(PF6): AD9959.10 NOREF#7.1 NOREF#14.1 NOREF#17.1 NOREF#45.1 STM32最小系统板.21
D7_7606(PB4): AD7606.1 U2.6
DAISY_8688(PC2): AD8688.4 STM32最小系统板.10
DATA_4302(PA11): PE4302.2 U2.35
LE_4302(PA15): PE4302.4 U2.27
P0_9959(PG6): AD9959.1 U2.38
P1_9959(PG7): AD9959.3 U2.37
P2_9959(PG8): AD9959.5 U2.36
P3_9959(PG9): AD9959.7 U2.21
PA1: STM32最小系统板.5 U3.3
PA4: DAC2.5 STM32最小系统板.12
PA5: DAC1(PA5).5 STM32最小系统板.11
PA6: ADC1(PA6).5 NOREF#9.1 NOREF#24.1 NOREF#28.1 U2.33
PA7: ADC2(PA7).5 STM32最小系统板.14
PA8: U2.41 U4.11
PB0: STM32最小系统板.15 U3.4
PB1: STM32最小系统板.18 U4.2
PB2: STM32最小系统板.17 U3.5
PB13: STM32最小系统板.23 U3.6
PB15: STM32最小系统板.49 U3.18
PC6: U2.50 U4.23
PC7: U2.49 U4.15
PC8: U2.40 U4.19
PC9: U2.39 U4.10
PC10: U2.45 U4.13
PC11: U2.44 U4.21
PC12: U2.42 U4.20
PD0: U2.26 四路继电器.1
PD1: U2.25 四路继电器.2
PD2: U2.43 U4.12 四路继电器.3
PD3: U2.24 四路继电器.4
PD4: U2.23 U4.9
PD5: U2.22 U4.18
PD6: U2.48 U4.22
PD7: U2.47 U4.14
PD8: STM32最小系统板.42 U3.21
PD9: STM32最小系统板.41 U3.15
PD10: STM32最小系统板.44 U3.22
PD11: STM32最小系统板.25 U3.7
PD12: STM32最小系统板.28 U4.4
PD13: STM32最小系统板.27 U3.8
PD14: STM32最小系统板.39 U3.14
PD15: STM32最小系统板.37 U3.13
PDC_9959(PG15): AD9959.4 NOREF#41.1 U2.46
PE5: U2.13 U4.8
PE6: U2.14 U4.16
PE7: STM32最小系统板.38 U3.19
PE8: STM32最小系统板.35 U3.12
PE9: STM32最小系统板.36 U4.24
PE10: STM32最小系统板.32 U4.6
PE11: STM32最小系统板.29 U3.9
PE12: STM32最小系统板.31 U3.10
PE13: STM32最小系统板.34 U4.7
PE14: STM32最小系统板.33 U3.11
PE15: STM32最小系统板.40 U3.20
PF2: STM32最小系统板.45 U3.17
PF3: STM32最小系统板.46 U3.23
PF4: STM32最小系统板.43 U3.16
PF5: STM32最小系统板.26 U4.3
PF12: STM32最小系统板.50 U3.24
PF13: STM32最小系统板.30 U4.5
PG10: U2.20 U4.17
RANGE_7606(PB12): AD7606.8 NOREF#12.1 NOREF#37.1 STM32最小系统板.24
RD_7606(PB3): AD7606.2 NOREF#3.1 U2.30
RESET: STM32最小系统板.3
RST_7606(PB6): AD7606.4 NOREF#42.1 U2.32
RST_8688(PC1): AD8688.5 NOREF#2.1 NOREF#8.1 NOREF#30.1 NOREF#31.1 U2.16
RST_9959(PF11): AD9959.6 NOREF#5.1 NOREF#25.1 NOREF#36.1 NOREF#40.1 STM32最小系统板.20
RX1(PA2): STM32最小系统板.8 串口屏.1
RX(PB10): U2.28 串口.1
SCK_5638(PE2): NOREF#44.1 TLV5638.3 U2.12
SCK_9959(PF7): AD9959.12 NOREF#13.1 NOREF#15.1 NOREF#16.1 NOREF#19.1 STM32最小系统板.22
SCL_5351(PF1): SI5351.4 STM32最小系统板.48
SCLK_8688(PC4): AD8688.2 STM32最小系统板.13
SD0_9959(PG11): AD9959.9 U2.10
SD1_9959(PG12): AD9959.11 U2.9
SD2_9959(PG13): AD9959.13 U2.8
SD3_9959(PG14): AD9959.14 NOREF#23.1 NOREF#39.1 U2.7
SDA_5351(PF0): SI5351.3 STM32最小系统板.47
SDC_8688(PC5): AD8688.1 STM32最小系统板.16
SDI_5638(PE3): NOREF#34.1 TLV5638.2 U2.11
SDI_8688(PC0): AD8688.6 NOREF#18.1 NOREF#32.1 U2.15
TX1(PA3): STM32最小系统板.9 串口屏.2
TX(PB11): U2.29 串口.2
UP_9959(PF8): AD9959.8 NOREF#4.1 NOREF#21.1 NOREF#22.1 NOREF#27.1 STM32最小系统板.19
$1N1573: LED1.1 R11.2

## Routing (per net, layer and track width the routed paths; a pad name or vN(x,y) marks a point on that pad's centre or on a via; arc(x,y) is an arc through that point)
3V3: length 189.8
  Top Layer w0.8: STM32最小系统板.2 STM32最小系统板.4 STM32最小系统板.6
  Bottom Layer w0.8: SI5351.1 7.49,37.2 7.49,76.5 13.91,82.92 27.66,82.92 29.72,80.86 STM32最小系统板.2 37.38,80.48 U3.1 54.86,80.57 56.51,82.22 89.15,82.22 92.84,85.9 97.16,85.9 99.3,83.76 99.3,47.42 96.94,45.07 TLV5638.6
+5V: length 54.1
  Top Layer w0.8: U2.3 70.23,78.06 70.23,98.22 71.31,99.3 76.12,99.3 R11.1 C3.2 79.5,98.08 C1.1 87.67,98.08 电源.1
  Bottom Layer w0.8: U4.1 70.26,80.57 U2.1 ; L3.1 88.41,90.66 电源.1
A5V: length 90.7
  Top Layer w0.8: NOREF#6.1 NOREF#26.1 ; NOREF#38.1 NOREF#33.1
  Bottom Layer w0.8: NOREF#26.1 88.65,13.29 C4.1 88.25,12.36 C5.2 88.35,7.06 AD7606.7 ; L3.2 NOREF#38.1 ; NOREF#33.1 92.2,42.98 92.2,42.09 90.81,40.69 NOREF#6.1
DGND: length 90.6
  Top Layer w0.254: NOREF.1 38.23,28.37 25.65,28.37 24.15,29.88 SI5351.2
  Bottom Layer w0.254: NOREF.1 43.56,71.93 U3.2
GND: length 67.1
  Top Layer w0.254: AD9959.2 96.52,86.79 NOREF#29.1 ; NOREF#35.1 67.26,92.71 L2.1
  Bottom Layer w0.254: C1.2 80.76,93.78 NOREF#35.1 ; NOREF#29.1 90.91,92.4 电源.2
CA_7606(PB7): length 80.4
  Top Layer w0.254: AD7606.5 64.26,21.74 64.26,40.56 63.75,41.07 62.48,41.07 59.44,44.12 59.44,58.97 61.85,61.38 63.33,61.38 67.09,57.62 U2.19
CLK_4302(PA12): length 44.6
  Bottom Layer w0.254: U2.34 90.77,39.84 94.23,36.37 94.23,18.77 PE4302.3
CS1_5638(PE0): length 29.2
  Top Layer w0.254: NOREF#11.1 73.69,59.36 U2.18
  Bottom Layer w0.254: TLV5638.5 85.07,59.36 NOREF#11.1
CS2_5638(PE1): length 31.7
  Top Layer w0.254: U2.17 71.03,60.16 72.26,61.39 74.68,61.39 NOREF#20.1
  Bottom Layer w0.254: NOREF#20.1 86.8,60.12 TLV5638.4
CS_7606(PB5): length 77.2
  Top Layer w0.254: NOREF#10.1 NOREF#43.1
  Bottom Layer w0.254: AD7606.3 79.93,1.07 91.69,1.07 91.87,1.25 91.87,1.86 92.13,2.12 92.13,3.18 91.87,3.43 91.87,36.19 NOREF#10.1 ; U2.31 70.35,42.84 71.12,43.61 88.52,43.61 NOREF#43.1
CS_8688(PC3): length 73.9
  Bottom Layer w0.254: AD8688.3 25.15,10.74 25.15,70.83 STM32最小系统板.7
CS_9959(PF6): length 137.9
  Top Layer w0.254: STM32最小系统板.21 27.14,55.04 NOREF#14.1 ; NOREF#17.1 95.88,90.09 96.52,89.46 96.52,89.45 98.63,87.34 98.63,76.82 96.52,74.71 AD9959.10 ; NOREF#45.1 NOREF#7.1
  Bottom Layer w0.254: NOREF#7.1 NOREF#14.1 ; NOREF#45.1 18.42,86.79 21.72,90.09 NOREF#17.1
D7_7606(PB4): length 90.6
  Bottom Layer w0.254: U2.6 72.89,75.36 71.63,74.09 62.1,74.09 58.29,70.28 58.29,17.7 AD7606.1
DAISY_8688(PC2): length 81.9
  Bottom Layer w0.254: STM32最小系统板.10 29.3,70.32 28.57,71.04 28.57,73.33 27.81,74.09 26.67,74.09 24.77,72.19 24.77,12.86 AD8688.4
DATA_4302(PA11): length 49.7
  Bottom Layer w0.254: U2.35 71.71,38.66 74.04,38.66 74.55,39.17 90.68,39.17 93.73,36.12 93.73,16.78 PE4302.2
LE_4302(PA15): length 53.5
  Bottom Layer w0.254: PE4302.4 94.87,20.64 94.87,42.34 87.88,49.33 74.42,49.33 73.85,48.76 71.25,48.76 70.35,47.86 U2.27
P0_9959(PG6): length 61.9
  Top Layer w0.254: U2.38 79.54,34.76 90.93,46.15 90.93,80.95 AD9959.1
P1_9959(PG7): length 63.5
  Top Layer w0.254: U2.37 71.66,33.45 79.25,33.45 91.69,45.9 91.69,79.17 AD9959.3
P2_9959(PG8): length 70.8
  Top Layer w0.254: AD9959.5 93.98,79.79 95.16,80.97 95.16,85.36 94.74,85.78 93.09,85.78 90.17,82.86 90.17,46.41 81.06,37.3 U2.36
P3_9959(PG9): length 46.9
  Bottom Layer w0.254: AD9959.7 94.6,76.38 95.78,75.2 96.83,75.2 97.7,74.33 97.7,74.31 97.79,74.22 97.79,68.12 96.39,66.73 78.61,66.73 73.91,62.03 73.91,60.74 74.02,60.63 74.02,59.69 73.91,59.58 73.91,58.2 74.02,58.09 74.02,57.15 73.36,56.49 71.51,56.49 70.35,55.33 U2.21
PA1: length 11.3
  Bottom Layer w0.254: U3.3 36.32,76.63 28.41,76.63 STM32最小系统板.5
PA4: length 29.9
  Top Layer w0.254: STM32最小系统板.12 28.54,66.6 21.84,66.6 14.61,73.84 DAC2.5
PA5: length 36.7
  Top Layer w0.254: STM32最小系统板.11 27.14,67.74 21.72,67.74 13.59,75.87 13.59,84 10.41,87.17 DAC1(PA5).5
PA6: length 82.6
  Top Layer w0.254: NOREF#9.1 7.24,60.5 ADC1(PA6).5 ; NOREF#28.1 22.61,38.53 57.78,38.53 NOREF#24.1
  Bottom Layer w0.254: NOREF#24.1 66.63,36.12 U2.33 ; NOREF#28.1 22.35,45.39 NOREF#9.1
PA7: length 38.2
  Top Layer w0.254: STM32最小系统板.14 28.59,64.11 28.59,62.23 27.84,61.49 19.78,61.49 14.99,56.69 14.99,51.39 10.51,46.91 4.53,46.91 4.27,47.17 ADC2(PA7).5
PA8: length 28.7
  Top Layer w0.254: U2.41 70.19,29.68 68.58,31.29 68.58,49.45 U4.11
PB0: length 15.6
  Bottom Layer w0.254: STM32最小系统板.15 27.34,62.7 28.57,63.93 30.23,63.93 31.12,64.82 31.12,66.6 U3.4
PB1: length 47.3
  Top Layer w0.254: STM32最小系统板.18 30.99,61.43 30.99,72.95 34.67,76.63 39.12,76.63 40.51,78.03 U4.2
PB2: length 15.7
  Bottom Layer w0.254: STM32最小系统板.17 28.41,61.39 30.48,61.39 30.99,61.9 30.99,63.93 U3.5
PB13: length 20.8
  Bottom Layer w0.254: U3.6 31.37,61.77 31.37,54.66 30.48,53.77 28.41,53.77 STM32最小系统板.23
PB15: length 23.1
  Bottom Layer w0.254: STM32最小系统板.49 28.36,20.7 30.05,20.7 30.23,20.88 30.23,20.97 35.79,26.54 35.79,35.72 U3.18
PC6: length 12.3
  Bottom Layer w0.254: U4.23 66.8,20.75 71.88,20.75 72.89,19.74 U2.50
PC7: length 29.6
  Top Layer w0.254: U2.49 67.06,22.82 67.06,42.6 64.64,45.01 U4.15
PC8: length 11.1
  Bottom Layer w0.254: U2.40 71.66,33.45 68.58,33.45 67.18,34.85 U4.19
PC9: length 28.6
  Top Layer w0.254: U2.39 70.32,32.22 68.96,33.58 68.96,51.61 U4.10
PC10: length 29.2
  Top Layer w0.254: U4.13 67.82,45.14 67.82,26.09 69.3,24.6 U2.45
PC11: length 11.1
  Bottom Layer w0.254: U2.44 71.53,28.5 67.69,28.5 66.42,29.77 U4.21
PC12: length 11.1
  Bottom Layer w0.254: U4.20 66.29,32.31 67.69,30.91 71.66,30.91 U2.42
PD0: length 39.2
  Bottom Layer w0.254: U2.26 87.97,50 95.5,42.47 95.5,31.48 四路继电器.1
PD1: length 40.9
  Bottom Layer w0.254: 四路继电器.2 95.88,33.6 95.88,42.72 87.38,51.23 71.25,51.23 70.35,50.34 U2.25
PD2: length 58.7
  Top Layer w0.254: U4.12 68.2,47.3 68.2,29.13 70.19,27.14 U2.43 70.78,27.14 72.01,28.37 74.93,28.37 81.26,34.7 四路继电器.3
PD3: length 33.5
  Bottom Layer w0.254: U2.24 86.7,52.54 97.28,41.96 四路继电器.4
PD4: length 10.8
  Top Layer w0.254: U2.23 70.35,52.76 U4.9
PD5: length 23.4
  Bottom Layer w0.254: U4.18 69.09,43.61 69.09,53.26 69.72,53.9 72.39,53.9 72.89,54.4 U2.22
PD6: length 12.2
  Bottom Layer w0.254: U4.22 66.8,23.29 71.5,23.29 72.73,22.06 U2.48
PD7: length 29.4
  Top Layer w0.254: U4.14 64.26,47.55 67.44,44.37 67.44,24.98 U2.47
PD8: length 7.8
  Top Layer w0.254: U3.21 37.38,29.68 STM32最小系统板.42
PD9: length 20.6
  Bottom Layer w0.254: STM32最小系统板.41 28.41,30.91 30.1,30.91 34.72,35.54 34.72,42.27 U3.15
PD10: length 7.8
  Top Layer w0.254: STM32最小系统板.44 29.81,27.23 U3.22
PD11: length 21.1
  Bottom Layer w0.254: U3.7 31.75,59.61 31.75,51.99 30.99,51.23 28.45,51.23 27.22,50 STM32最小系统板.25
PD12: length 55.7
  Top Layer w0.254: U4.4 41.28,72.95 40,71.68 33.4,71.68 31.88,70.16 31.88,49.62 STM32最小系统板.28
PD13: length 21.4
  Bottom Layer w0.254: STM32最小系统板.27 28.41,48.69 31.5,48.69 32.13,49.33 32.13,57.45 U3.8
PD14: length 20.5
  Bottom Layer w0.254: U3.14 34.37,44.45 34.37,37.81 30.19,33.63 28.59,33.63 STM32最小系统板.39
PD15: length 20.6
  Bottom Layer w0.254: U3.13 34.01,46.64 34.01,39.91 30.09,35.99 28.45,35.99 27.22,34.76 STM32最小系统板.37
PDC_9959(PG15): length 86.9
  Top Layer w0.254: NOREF#41.1 92.46,46.91 98.62,40.75 98.62,27.04 96.14,24.56 72.93,24.56 U2.46
  Bottom Layer w0.254: AD9959.4 98.3,79.68 98.3,67.49 92.46,61.65 NOREF#41.1
PE5: length 8.5
  Bottom Layer w0.254: U4.8 66.55,62.79 68.71,64.95 70.06,64.95 U2.13
PE6: length 28.4
  Bottom Layer w0.254: U2.14 72.89,65.2 71.63,63.93 69.09,63.93 68.33,63.17 68.33,47.93 U4.16
PE7: length 7.8
  Top Layer w0.254: U3.19 37.38,34.76 STM32最小系统板.38
PE8: length 21.8
  Bottom Layer w0.254: STM32最小系统板.35 28.41,38.53 32.13,38.53 33.66,40.06 33.66,48.82 U3.12
PE9: length 39.4
  Top Layer w0.254: U4.24 48.9,36.12 34.93,36.12 33.74,37.3 STM32最小系统板.36
PE10: length 55.3
  Top Layer w0.254: STM32最小系统板.32 32.89,45.56 32.89,65.33 34.16,66.6 61.59,66.6 U4.6
PE11: length 21.5
  Bottom Layer w0.254: U3.9 32.51,55.3 32.51,47.04 31.62,46.15 28.41,46.15 STM32最小系统板.29
PE12: length 21.5
  Bottom Layer w0.254: STM32最小系统板.31 27.18,42.47 28.32,43.61 31.62,43.61 32.89,44.88 32.89,53.14 U3.10
PE13: length 54.8
  Top Layer w0.254: STM32最小系统板.34 33.27,43.4 33.27,62.41 35.07,64.2 37.93,64.2 39.06,65.33 U4.7
PE14: length 21.8
  Bottom Layer w0.254: STM32最小系统板.33 27.18,39.93 28.45,41.2 32.26,41.2 33.27,42.22 33.27,50.98 U3.11
PE15: length 7.8
  Top Layer w0.254: U3.20 29.81,32.31 STM32最小系统板.40
PF2: length 20.5
  Bottom Layer w0.254: U3.17 35.44,37.9 35.44,31.26 30.19,26.01 28.59,26.01 STM32最小系统板.45
PF3: length 7.8
  Top Layer w0.254: U3.23 37.38,24.6 STM32最小系统板.46
PF4: length 20.6
  Bottom Layer w0.254: U3.16 35.08,40.08 35.08,33.35 30.1,28.37 28.41,28.37 STM32最小系统板.43
PF5: length 56.4
  Top Layer w0.254: STM32最小系统板.26 30.06,50.34 30.73,50.34 31.37,50.98 31.37,72.69 32.77,74.09 38.74,74.09 40.13,75.49 U4.3
PF12: length 8.8
  Bottom Layer w0.254: STM32最小系统板.50 34.84,19.52 U3.24
PF13: length 55.9
  Top Layer w0.254: U4.5 41.28,70.41 40,69.14 33.15,69.14 32.38,68.38 32.38,47.59 STM32最小系统板.30
PG10: length 23.3
  Bottom Layer w0.254: U2.20 72.89,57.2 71.53,57.2 70.77,56.44 69.6,56.44 68.71,55.55 68.71,45.77 U4.17
RANGE_7606(PB12): length 115.4
  Top Layer w0.254: STM32最小系统板.24 29.72,52.5 28.45,51.23 25.02,51.23 NOREF#12.1 ; AD7606.8 89.14,0.94 38.61,0.94 NOREF#37.1
  Bottom Layer w0.254: NOREF#37.1 NOREF#12.1
RD_7606(PB3): length 80
  Top Layer w0.254: NOREF#3.1 75.18,42.63 U2.30
  Bottom Layer w0.254: AD7606.2 75.85,2.05 77.34,0.56 91.95,0.56 93.73,2.34 93.73,16.28 93.37,16.63 93.37,35.59 90.42,38.53 NOREF#3.1
RST_7606(PB6): length 43
  Top Layer w0.254: NOREF#42.1 74.42,40.85 U2.32
  Bottom Layer w0.254: NOREF#42.1 74.42,35.86 80.85,29.44 AD7606.4
RST_8688(PC1): length 109.2
  Top Layer w0.254: NOREF#8.1 71.59,61.39 U2.16 ; NOREF#2.1 58.55,63.55 NOREF#30.1 ; AD8688.5 12.38,13.2 16.51,17.32 39.88,17.32 NOREF#31.1
  Bottom Layer w0.254: NOREF#30.1 57.4,34.85 NOREF#31.1 ; NOREF#8.1 61.47,61.39 NOREF#2.1
RST_9959(PF11): length 126.5
  Top Layer w0.254: NOREF#40.1 24.64,57.58 25.91,58.85 28.49,58.85 STM32最小系统板.20 ; NOREF#36.1 NOREF#5.1 ; AD9959.6 97.92,80.31 97.92,87.05 96.9,88.06 NOREF#25.1
  Bottom Layer w0.254: NOREF#25.1 22.86,88.06 NOREF#36.1 ; NOREF#5.1 NOREF#40.1
RX1(PA2): length 34.8
  Top Layer w0.254: STM32最小系统板.8 28.49,74.09 18.03,74.09 16.62,75.51 串口屏.1
RX(PB10): length 12.7
  Top Layer w0.254: 串口.1 73.09,47.66 U2.28
SCK_5638(PE2): length 32.6
  Top Layer w0.254: U2.12 72.89,67.75 74.17,66.47 74.17,62.66 NOREF#44.1
  Bottom Layer w0.254: NOREF#44.1 76.06,61 86.88,61 95.31,52.57 TLV5638.3
SCK_9959(PF7): length 147.8
  Top Layer w0.254: STM32最小系统板.22 29.72,54.41 29.08,53.77 18.8,53.77 NOREF#16.1 ; AD9959.12 96.52,72.17 98.99,74.64 98.99,87.5 95.25,91.24 NOREF#15.1 ; NOREF#19.1 NOREF#13.1
  Bottom Layer w0.254: NOREF#19.1 21.34,91.24 NOREF#15.1 ; NOREF#13.1 NOREF#16.1
SCL_5351(PF1): length 29.3
  Top Layer w0.254: SI5351.4 22.17,24.88 26.29,20.75 28.41,20.75 STM32最小系统板.48
SCLK_8688(PC4): length 65.3
  Bottom Layer w0.254: AD8688.2 25.53,8.62 25.53,63.3 27.18,64.95 STM32最小系统板.13
SD0_9959(PG11): length 22.5
  Bottom Layer w0.254: AD9959.9 76.41,73.84 U2.10
SD1_9959(PG12): length 25.1
  Bottom Layer w0.254: AD9959.11 75.95,71.3 73.66,69.01 71.66,69.01 U2.9
SD2_9959(PG13): length 29.7
  Bottom Layer w0.254: AD9959.13 95.25,70.03 95.25,74.47 94.68,75.04 75.08,75.04 U2.8
SD3_9959(PG14): length 30.6
  Top Layer w0.254: U2.7 70.35,72.83 71.63,71.55 73.28,71.55 NOREF#39.1 ; AD9959.14 NOREF#23.1
  Bottom Layer w0.254: NOREF#23.1 NOREF#39.1
SDA_5351(PF0): length 26.7
  Top Layer w0.254: STM32最小系统板.47 21.86,27.38 SI5351.3
SDC_8688(PC5): length 63.8
  Bottom Layer w0.254: AD8688.1 25.91,6.5 25.91,60.63 26.67,61.39 27.56,61.39 28.87,62.7 STM32最小系统板.16
SDI_5638(PE3): length 35.1
  Top Layer w0.254: U2.11 70.35,68.12 71.25,69.01 73.41,69.01 76.07,66.34 NOREF#34.1
  Bottom Layer w0.254: TLV5638.2 93.68,55.07 87.1,61.65 77.09,61.65 NOREF#34.1
SDI_8688(PC0): length 107.3
  Top Layer w0.254: NOREF#32.1 39.37,17.83 16.38,17.83 9.88,11.33 AD8688.6 ; U2.15 70.19,62.7 68.69,64.2 58.43,64.2 NOREF#18.1
  Bottom Layer w0.254: NOREF#18.1 56.64,35.1 NOREF#32.1
TX1(PA3): length 35.4
  Top Layer w0.254: STM32最小系统板.9 27.14,70.28 20.07,70.28 14.12,76.23 串口屏.2
TX(PB11): length 16
  Top Layer w0.254: U2.29 71.59,46.15 74.04,46.15 75.04,45.16 串口.2
UP_9959(PF8): length 130.2
  Top Layer w0.254: NOREF#27.1 NOREF#21.1 ; STM32最小系统板.19 27.18,57.33 26.29,56.44 20.32,56.44 NOREF#4.1 ; NOREF#22.1 96.39,89.08 98.27,87.19 98.27,79 96.52,77.25 AD9959.8
  Bottom Layer w0.254: NOREF#21.1 NOREF#4.1 ; NOREF#22.1 22.22,89.08 19.24,86.09
$1N1573: length 2
  Top Layer w0.254: LED1.1 75.33,96.33 R11.2

## Copper pours and planes (outline as drawn; the poured copper is in the pictures)
AGND on Bottom Layer: 83.31,100 100,100 100,87.05 83.31,87.05
DGND on Top Layer: 0,36.88 0,16.94 81.53,16.94 81.66,17.07 81.66,36.87 81.65,36.87 0.01,36.87
DGND on Top Layer: 22.99,91.87 81.53,91.87 81.53,16.94 22.99,16.94
DGND on Bottom Layer: 0,36.8 81.28,36.8 81.28,16.94 0,16.94
DGND on Bottom Layer: 22.99,91.87 81.28,91.87 81.28,16.94 22.99,16.94
GND on Top Layer: -1.61,102.47 100.97,102.47 100.97,-0.71 -1.61,-0.71
GND on Bottom Layer: 0,100 100,100 100,0 0,0

## Text on the board
Bottom Silkscreen Layer: PD8 | PE15 | PD10 | PF3 | GND | PA1 | PB0 | PB2 | PB13 | PE11 | PE12 | PF12 | PE7 | 3V3 | PD11 | PD13 | PE14 | PE8 | PD15 | PD14 | PD9 | PF4 | PF2 | PB15 | PC11 | PC12 | PD6 | PC6 | PB1 | PF5 | PD12 | PF13 | PE10 | PD4 | PC9 | PE9 | PC8 | +5V | PE13 | PE5 | PA8 | PD2 | PC10 | PD7 | PC7 | PE6 | PG10 | PD5
Top Silkscreen Layer: RESET | PB13 | PD13 | PE12 | PE14 | PD15 | PD14 | PB15 | PA1 | PC3 | GND | PA3 | PF8 | PA5 | PC4 | PB0 | PB2 | PD11 | PE11 | PF6 | PE8 | PD9 | PF4 | PF2 | PF0 | VREF | PD12 | PF13 | PE10 | PE13 | PE15 | PF12 | PE9 | PD10 | PF3 | PF1 | PB12 | PF11 | PA7 | PC5 | PB1 | PF5 | PE7 | PD8 | 3V3 | PA4 | PF7 | PC2 | PA2 | +5V | VBAT | PG14 | PG12 | PE3 | PE5 | PC0 | PD1 | PA15 | PB11 | PB5 | PA6 | PA11 | PG7 | PC9 | PA8 | PD2 | PC10 | PD7 | PC7 | PE1 | PB7 | PG9 | PD4 | PB4 | PG13 | PG11 | PE2 | PE6 | PC1 | PE0 | PG10 | PD5 | PD3 | PB10 | PB3 | PB6 | PD0 | PA12 | PG8 | PG6 | PC8 | PC12 | PC11 | PG15 | PD6 | PC6 | DATA | SDA | SCL | SDI | RST | DAISY | CS | SCLK | SDC | SD2 SD3 | SD1 SCK | P0 GND | P3  UP | SD0 CS | P2 RST | P1 PDC | CLK | LE | D7 | RD | CA | 5V | RANGE | SCK | CS2 | CS1 | TX | RX | 2025电赛_拓展板_pjh_smy_lzn
